# Altium schematic sheet Multiplexers.SchDoc: Peripherals
size Letter; Date: 2017-02-17; Revision: A; SheetNumber: 6; SheetTotal: 11; ProjectTitle: PDUv17: Power Distribution Unit
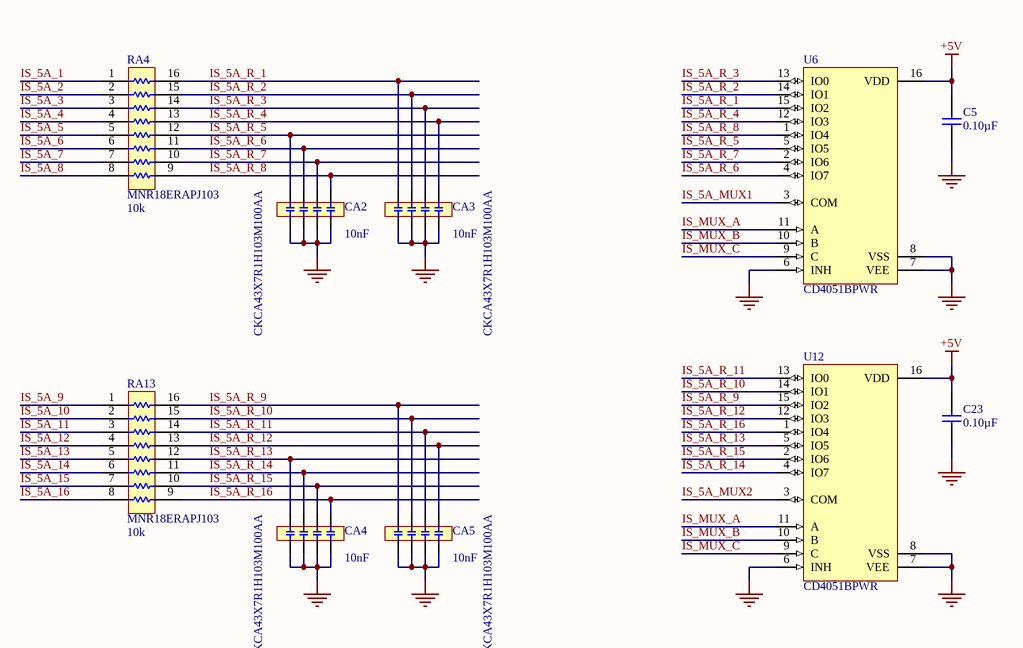
[diagram p0: Multiplexers.SchDoc]

## Parts
C5  value 0.10µF  [CAP-0402-M]  (hidden comment: CAP 0.10µF ±10% 16V 0402 X7R)
C23  value 0.10µF  [CAP-0402-M]  (hidden comment: CAP 0.10µF ±10% 16V 0402 X7R)
CA2  CKCA43X7R1H103M100AA  value 10nF  [CAF-80P319X159-8N]
CA3  CKCA43X7R1H103M100AA  value 10nF  [CAF-80P319X159-8N]
CA4  CKCA43X7R1H103M100AA  value 10nF  [CAF-80P319X159-8N]
CA5  CKCA43X7R1H103M100AA  value 10nF  [CAF-80P319X159-8N]
RA4  MNR18ERAPJ103  value 10k  [CAC-50P379X150-16N]
RA13  MNR18ERAPJ103  value 10k  [CAC-50P379X150-16N]
U6  CD4051BPWR  [TSOP65P640X120-16N]
U12  CD4051BPWR  [TSOP65P640X120-16N]

## Nets
+5V: C5.2 C23.2 U6.16(VDD) U12.16(VDD)
GND: C5.1 C23.1 CA2.1 CA2.2 CA2.3 CA2.4 CA3.1 CA3.2 CA3.3 CA3.4 CA4.1 CA4.2 CA4.3 CA4.4 CA5.5 CA5.6 CA5.7 CA5.8 U6.6(INH) U6.7(VEE) U6.8(VSS) U12.6(INH) U12.7(VEE) U12.8(VSS)
IS_5A_1: RA4.1
IS_5A_2: RA4.2
IS_5A_3: RA4.3
IS_5A_4: RA4.4
IS_5A_5: RA4.5
IS_5A_6: RA4.6
IS_5A_7: RA4.7
IS_5A_8: RA4.8
IS_5A_9: RA13.1
IS_5A_10: RA13.2
IS_5A_11: RA13.3
IS_5A_12: RA13.4
IS_5A_13: RA13.5
IS_5A_14: RA13.6
IS_5A_15: RA13.7
IS_5A_16: RA13.8
IS_5A_MUX1: U6.3(COM)
IS_5A_MUX2: U12.3(COM)
IS_5A_R_1: CA3.5 RA4.16 U6.15(IO2)
IS_5A_R_2: CA3.6 RA4.15 U6.14(IO1)
IS_5A_R_3: CA3.7 RA4.14 U6.13(IO0)
IS_5A_R_4: CA3.8 RA4.13 U6.12(IO3)
IS_5A_R_5: CA2.5 RA4.12 U6.5(IO5)
IS_5A_R_6: CA2.6 RA4.11 U6.4(IO7)
IS_5A_R_7: CA2.7 RA4.10 U6.2(IO6)
IS_5A_R_8: CA2.8 RA4.9 U6.1(IO4)
IS_5A_R_9: CA5.1 RA13.16 U12.15(IO2)
IS_5A_R_10: CA5.2 RA13.15 U12.14(IO1)
IS_5A_R_11: CA5.3 RA13.14 U12.13(IO0)
IS_5A_R_12: CA5.4 RA13.13 U12.12(IO3)
IS_5A_R_13: CA4.5 RA13.12 U12.5(IO5)
IS_5A_R_14: CA4.6 RA13.11 U12.4(IO7)
IS_5A_R_15: CA4.7 RA13.10 U12.2(IO6)
IS_5A_R_16: CA4.8 RA13.9 U12.1(IO4)
IS_MUX_A: U6.11(A) U12.11(A)
IS_MUX_B: U6.10(B) U12.10(B)
IS_MUX_C: U6.9(C) U12.9(C)

## Notes on the sheet
- Date:
- Revision:
- Sheet:
- /

## Library data of the parts
C5 C23 = CC0402KRX7R7BB104: Manufacturer: Yageo; Manufacturer Series: CC; Part Number: CC0402KRX7R7BB104; Component Type: Standard; Tolerance: ±10%; Voltage: 16V; Package: 0402; Temperature Coefficient: X7R; Temperature Range: -55°C ~ 125°C; Supplier 1: Digi-Key; Supplier Part Number 1: 311-1338-1-ND